# Altium schematic sheet Top.SchDoc: Top Sheet
size A; Author: Boris Cherkasskiy; CompanyName: DMC; DrawnBy: Boris Cherkasskiy; Engineer: Boris Cherkasskiy; Organization: DMC; Project: 915MHz Antenna
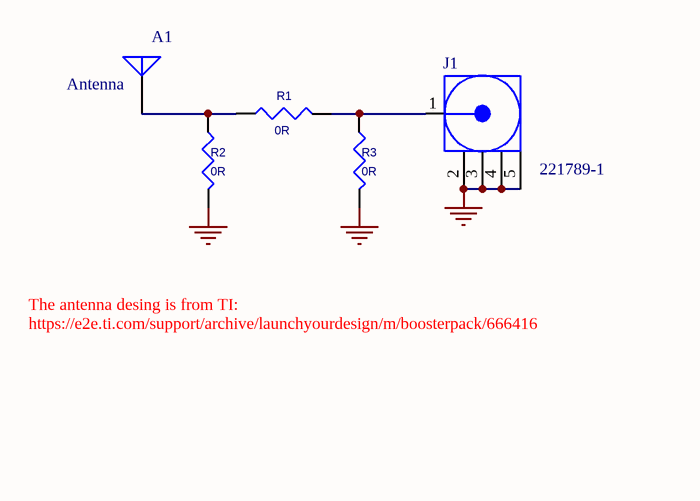
[diagram p0: Top.SchDoc]

## Parts
A1  Antenna  [LoRa Ant]
J1  221789-1  [SMA 221789-1]
R1  0R  [RESC1608N]
R2  0R  [RESC1608N]
R3  0R  [RESC1608N]

## Nets
GND: J1.2(G) J1.3(G) J1.4(G) J1.5(G) R2.1 R3.1
NetA1_1: A1.1(A) R1.2 R2.2
NetJ1_1: J1.1(X) R1.1 R3.2

## Notes on the sheet
- The antenna desing is from TI: https://e2e.ti.com/support/archive/launchyourdesign/m/boosterpack/666416
- Title
- Date:
- Project
- Sheet:
- Company
- File:
- Author:

## Library data of the parts
A1 = Antenna: PCB Antenna
J1 = SMA 221789-1: CONN SMA JACK STR 50 OHM PCB; Supplier 1: Digi-Key; Supplier Part Number 1: A24691-ND
R1-R3 = R_Dup2: SMT PART 0603